# Altium schematic sheet Pressure-Sensor.SchDoc
size A4
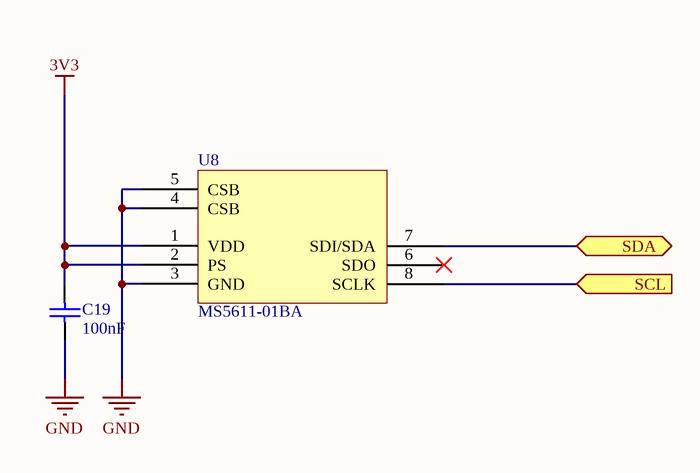
[diagram p0: Pressure-Sensor.SchDoc]

## Parts
C19  100nF  [C0603(1608)]
U8  MS5611-01BA  [MS5611-01BA01]

## Ports
SCL (in), SDA (bidir)

## Nets
3V3: C19.2 U8.1(VDD) U8.2(PS)
GND: C19.1 U8.3(GND) U8.4(CSB) U8.5(CSB)
SCL: U8.8(SCLK) ; port SCL
SDA: U8.7(SDI/SDA) ; port SDA

Not connected (* = marked no-connect by the designer): U8 6(SDO)*

## Library data of the parts
C19 = Cap: Capacitor
U8 = SENSOR: Barometric Pressure Sensor